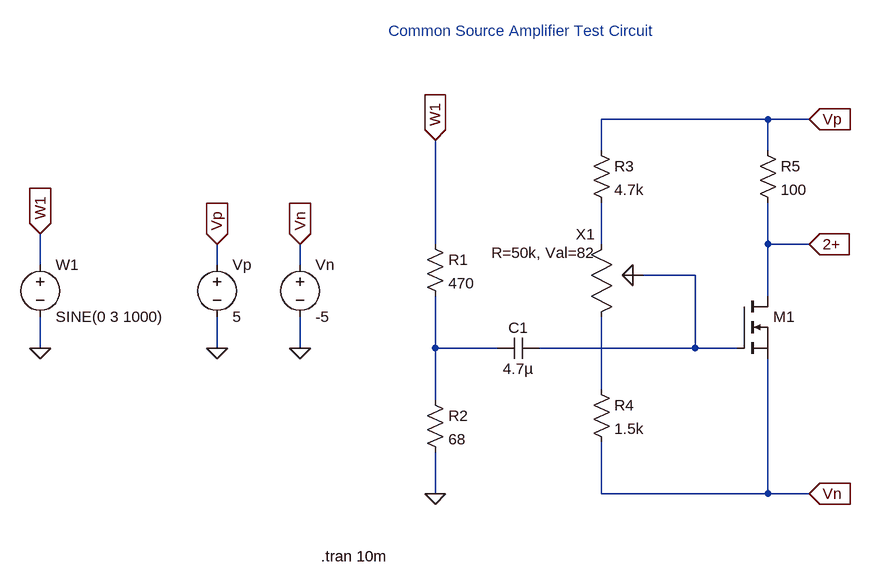
[diagram p0: schematic csamp_tc_ltspice.asc]
csamp_tc_ltspice.asc, the LTspice schematic file:
Version 4
SHEET 1 908 680
WIRE 480 -256 224 -256
WIRE 544 -256 480 -256
WIRE 224 -208 224 -256
WIRE 480 -208 480 -256
WIRE -32 -64 -32 -224
WIRE 224 -64 224 -128
WIRE 480 -64 480 -128
WIRE 544 -64 480 -64
WIRE -640 -32 -640 -80
WIRE -368 -32 -368 -64
WIRE -240 -32 -240 -64
WIRE 368 -16 288 -16
WIRE 480 16 480 -64
WIRE -640 96 -640 48
WIRE -368 96 -368 48
WIRE -240 96 -240 48
WIRE -32 96 -32 16
WIRE 64 96 -32 96
WIRE 368 96 368 -16
WIRE 368 96 128 96
WIRE 432 96 368 96
WIRE 224 160 224 48
WIRE -32 176 -32 96
WIRE -32 320 -32 256
WIRE 224 320 224 240
WIRE 480 320 480 112
WIRE 480 320 224 320
WIRE 544 320 480 320
FLAG -32 320 0
FLAG -32 -224 W1
IOPIN -32 -224 In
FLAG 544 -256 Vp
IOPIN 544 -256 In
FLAG 544 320 Vn
IOPIN 544 320 In
FLAG -640 96 0
FLAG -640 -80 W1
IOPIN -640 -80 In
FLAG -368 96 0
FLAG -240 96 0
FLAG -240 -64 Vn
IOPIN -240 -64 In
FLAG -368 -64 Vp
IOPIN -368 -64 In
FLAG 544 -64 2+
IOPIN 544 -64 In
SYMBOL res -48 -80 R0
SYMATTR InstName R1
SYMATTR Value 470
SYMBOL res -48 160 R0
SYMATTR InstName R2
SYMATTR Value 68
SYMBOL res 208 -224 R0
SYMATTR InstName R3
SYMATTR Value 4.7k
SYMBOL res 208 144 R0
SYMATTR InstName R4
SYMATTR Value 1.5k
SYMBOL res 464 -224 R0
SYMATTR InstName R5
SYMATTR Value 100
SYMBOL cap 128 80 R90
WINDOW 0 0 32 VBottom 2
WINDOW 3 32 32 VTop 2
SYMATTR InstName C1
SYMATTR Value 4.7µ
SYMBOL nmos 432 16 R0
WINDOW 3 56 72 Invisible 2
SYMATTR Value BSP89
SYMATTR InstName M1
SYMBOL voltage -640 -48 R0
WINDOW 123 0 0 Left 0
WINDOW 39 0 0 Left 0
SYMATTR InstName W1
SYMATTR Value SINE(0 3 1000)
SYMBOL voltage -368 -48 R0
WINDOW 123 0 0 Left 0
WINDOW 39 0 0 Left 0
SYMATTR InstName Vp
SYMATTR Value 5
SYMBOL voltage -240 -48 R0
WINDOW 123 0 0 Left 0
WINDOW 39 0 0 Left 0
SYMATTR InstName Vn
SYMATTR Value -5
SYMBOL potentiometer 240 -48 M0
WINDOW 0 26 -31 Left 2
WINDOW 39 26 -3 Left 2
SYMATTR InstName X1
SYMATTR SpiceLine R=50k, Val=82
TEXT -208 416 Left 2 !.tran 10m
TEXT -104 -392 Left 2 ;Common Source Amplifier Test Circuit

The netlist it stands for:
* csamp_tc_ltspice.asc
R1 W1 N003 470
R2 N003 0 68
R3 Vp N001 4.7k
R4 N004 Vn 1.5k
R5 Vp 2+ 100
C1 N002 N003 4.7µ
M1 2+ N002 Vn Vn BSP89
V§W1 W1 0 SINE(0 3 1000)
Vp Vp 0 5
Vn Vn 0 -5
XX1 N001 N002 N004 potentiometer R=50k, Val=82  ; pins 1 2 3
.model NMOS NMOS
.model PMOS PMOS
.lib standard.mos
.tran 10m
* Common Source Amplifier Test Circuit
.backanno
.end